# Altium project Nhom4.PrjPcb
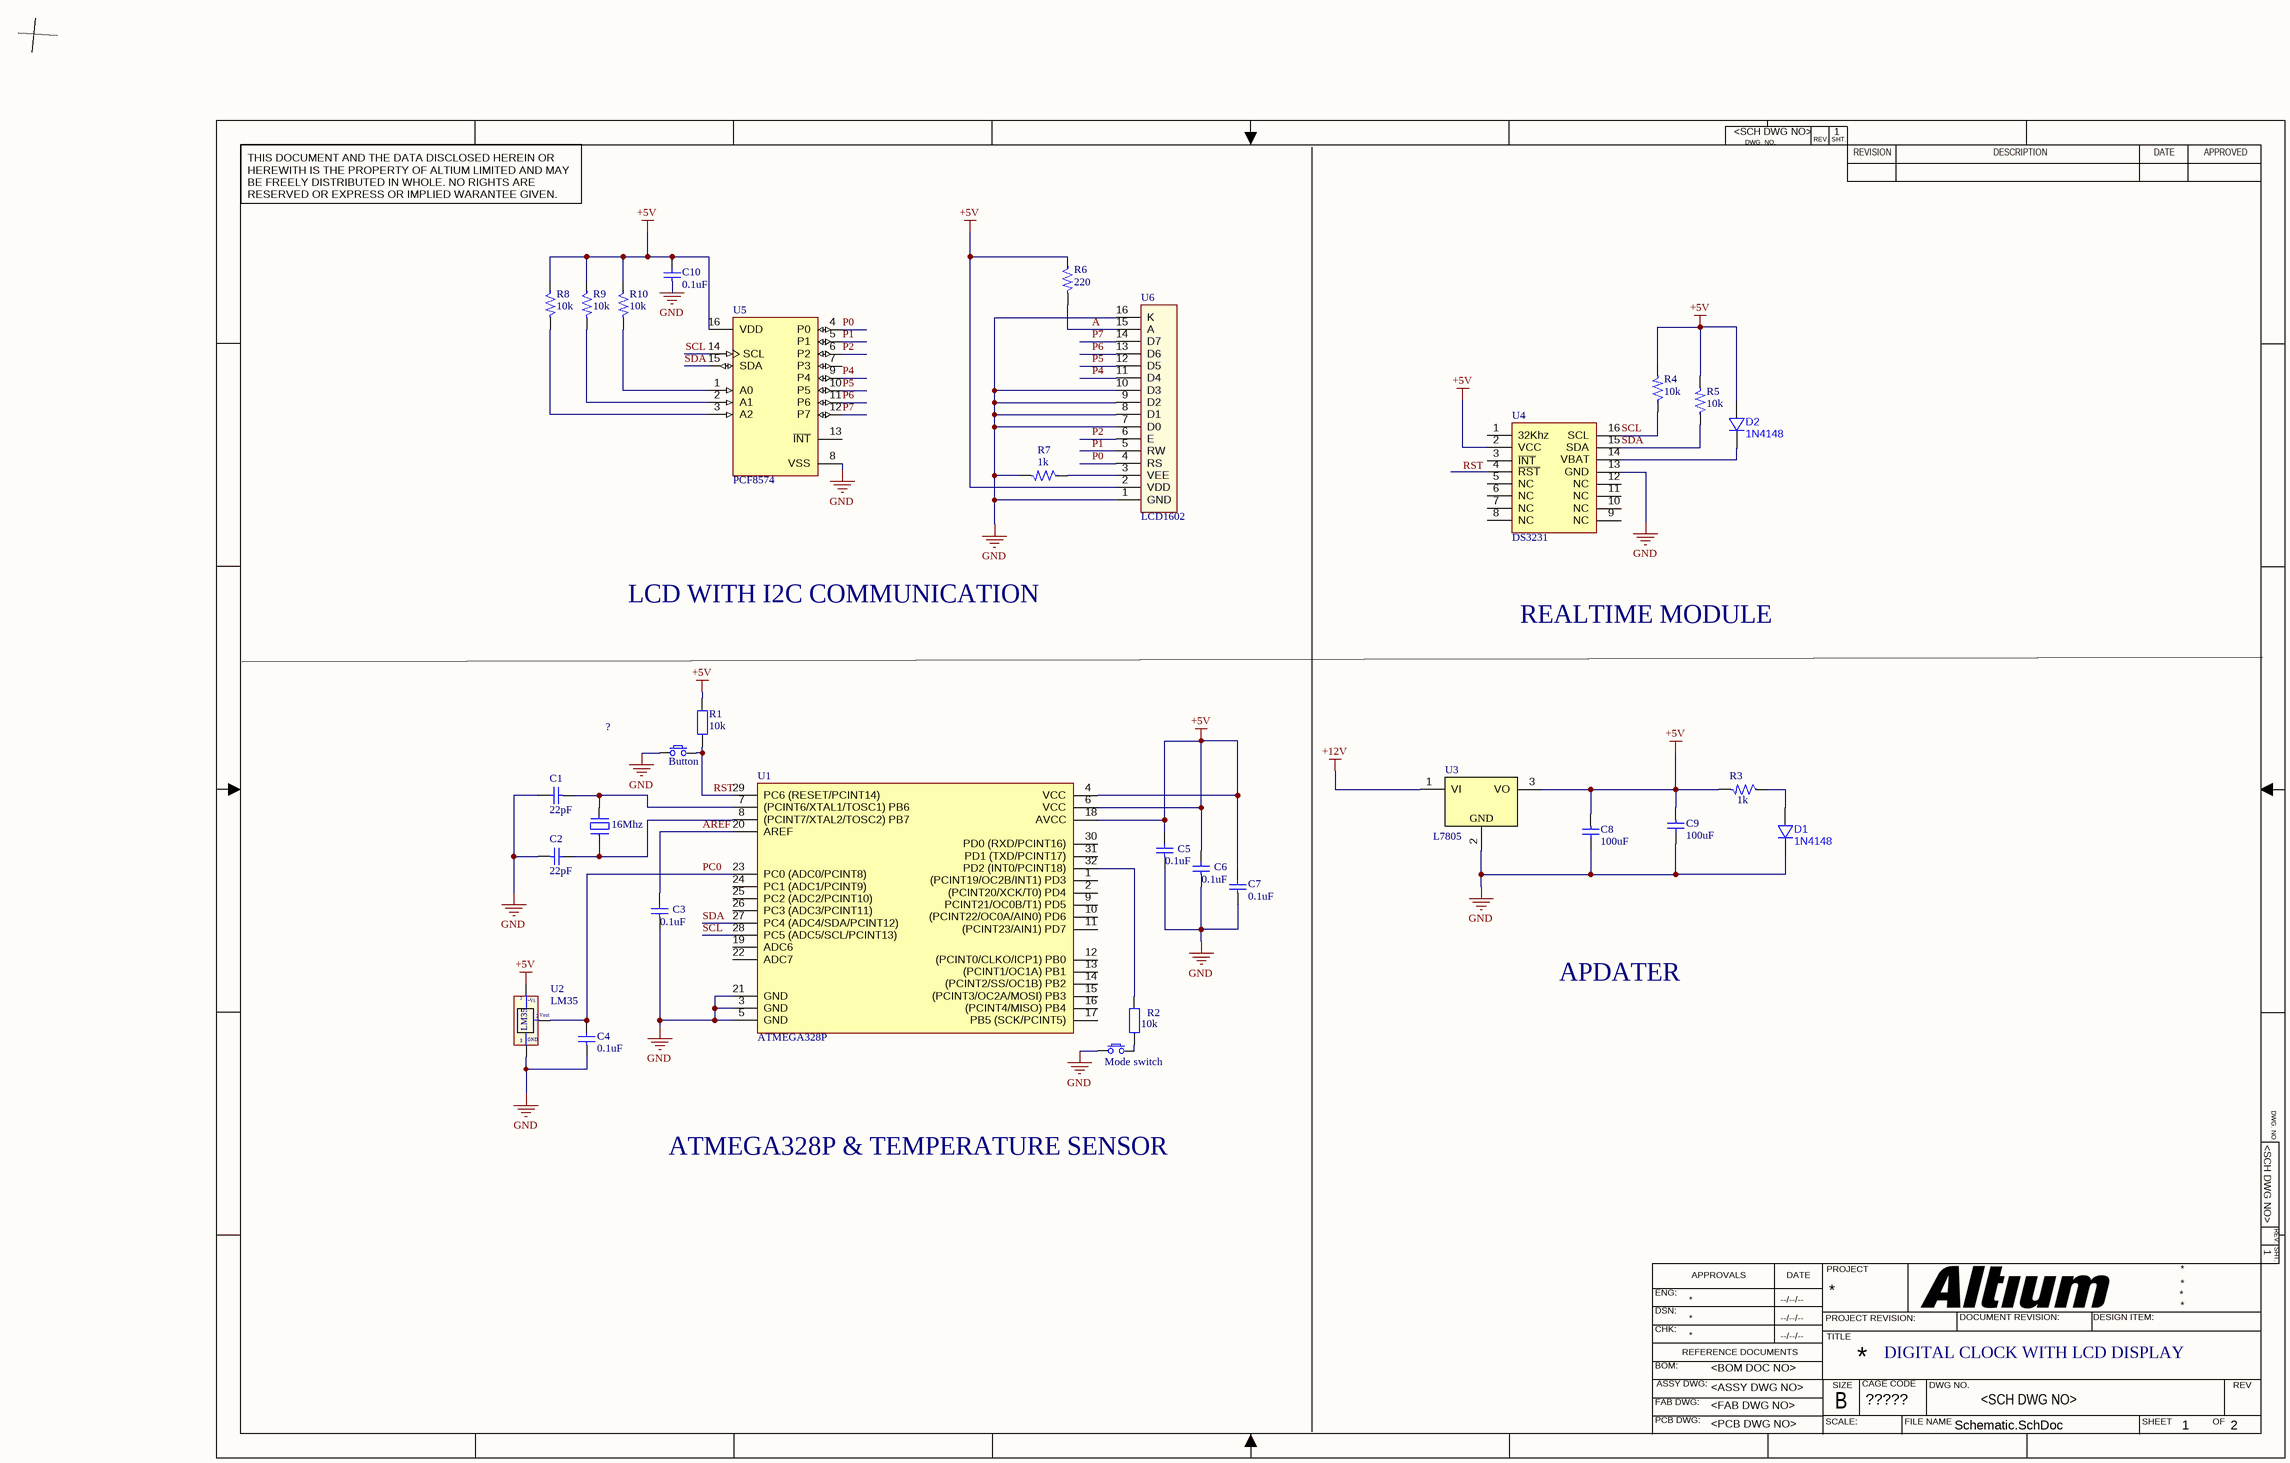
[diagram p0: Schematic.SchDoc]
CAGE_CODE: ?????; CONTRACT_NUMBER: <CONTRACT NO>; DOC_NO_ASSY_DWG: <ASSY DWG NO>; DOC_NO_BOM: <BOM DOC NO>; DOC_NO_FAB_DWG: <FAB DWG NO>; DOC_NO_SCH_DWG: <SCH DWG NO>; PCB_2_DEC_TOL: +/-.01; PCB_3_DEC_TOL: +/-.010; PCB_ANG_TOL: +/-1/2; PCB_ASSEMBLY_NO: <PCB ASSY NO>; PCB_CHECKER: - -----; PCB_CHECKER_APP_DATE: --/--/----; PCB_DESIGNER: - -----; PCB_DESIGNER_APP_DATE: --/--/----; PCB_DWG_NO: <PCB DWG NO>; PCB_ENGINEER: - -----; PCB_ENGINEER_APP_DATE: --/--/----; PCB_PART_NUMBER: <PCB PN>; PCB_REV: A; SCH_REV: A
3 sheets, 71 parts. Net scope: global (net labels, ports and power ports of the same name join across sheets).
Board file: Final PCB.PcbDoc
Sheets:
  Schematic.SchDoc
  Block Diagram.SchDoc
  Final Schematic.SchDoc

## Sheet Schematic.SchDoc
size 431 x 279 mm; SheetNumber: 1; SheetTotal: 2; ENG_APP_DATE: --/--/--; DSN_APP_DATE: --/--/--; CHK_APP_DATE: --/--/--

### Parts
(Parts that share a designator on the sheet are numbered #1, #2 ... from top to bottom, then left to right.)
?#1  Button  [SW/2/DIP]
?#2  16Mhz  [Thach Anh 2 chan SMD]
C1#1  22pF  [C 0402 (1005)]
C2#1  22pF  [C 0402 (1005)]
C3#1  0.1uF  [C 0402 (1005)]
C4#1  0.1uF  [C 0402 (1005)]
C5#1  0.1uF  [C 0402 (1005)]
C6#1  0.1uF  [C 0402 (1005)]
C7#1  0.1uF  [C 0402 (1005)]
C8#1  100uF  [C 0402 (1005)]
C9#1  100uF  [C 0402 (1005)]
C10#1  0.1uF  [C 0402 (1005)]
D1#1  1N4148  [SOD523F]
D2#1  1N4148  [SOD523F]
Mode_switch  (no value)  [SW/2/DIP]
R1#1  10k  [tro vach 1/4w]
R2#1  10k  [tro vach 1/4w]
R3#1  1k  [R1/4W]
R4#1  10k  [R1/4W]
R5#1  10k  [R1/4W]
R6#1  220  [R1/4W]
R7#1  1k  [R1/4W]
R8#1  10k  [SM-RES-1206]
R9#1  10k  [SM-RES-1206]
R10#1  10k  [SM-RES-1206]
U1#1  ATMEGA328P  [TQFP-32]
U2#1  LM35  [QTO-92]
U3#1  L7805  [DPAK_118_446_112X59_SMD]
U4#1  DS3231  [SOIC 16]
U5#1  PCF8574  [FP-SOT162-1-MFG]
U6  LCD1602  [LCD1602 with Jump]

### Nets
+5V: C5#1.2 C6#1.2 C7#1.2 C8#1.1 C9#1.1 C10#1.2 D2#1.A R1#1.2 R3#1.2 R4#1.2 R5#1.2 R6#1.1 R8#1.1 R9#1.1 R10#1.1 U1#1.4(VCC) U1#1.6(VCC) U1#1.18(AVCC) U2#1.1(+Vs) U3#1.3(VO) U4#1.2(VCC) U5#1.16(VDD) U6.2(VDD)
+12V: U3#1.1(VI)
GND: ?#1.1 C1#1.2 C2#1.1 C3#1.1 C4#1.1 C5#1.1 C6#1.1 C7#1.1 C8#1.2 C9#1.2 C10#1.1 D1#1.K Mode_switch.1 R7#1.2 U1#1.3(GND) U1#1.5(GND) U1#1.21(GND) U2#1.3(-) U3#1.2 U4#1.13(GND) U5#1.8(VSS) U6.1(GND) U6.7(D0) U6.8(D1) U6.9(D2) U6.10(D3) U6.16(K)
A: R6#1.2 U6.15(A)
AREF: C3#1.2 U1#1.20(AREF)
P0: U5#1.4(P0) U6.4(RS)
P1: U5#1.5(P1) U6.5(RW)
P2: U5#1.6(P2) U6.6(E)
P4: U5#1.9(P4) U6.11(D4)
P5: U5#1.10(P5) U6.12(D5)
P6: U5#1.11(P6) U6.13(D6)
P7: U5#1.12(P7) U6.14(D7)
PC0: C4#1.2 U1#1.23(PC0_(ADC0/PCINT8)) U2#1.2(Vout)
RST: ?#1.2 R1#1.1 U1#1.29(PC6_(RESET/PCINT14))
SCL: R4#1.1 U1#1.28(PC5_(ADC5/SCL/PCINT13)) U4#1.16(SCL) U5#1.14(SCL)
SDA: R5#1.1 U1#1.27(PC4_(ADC4/SDA/PCINT12)) U4#1.15(SDA) U5#1.15(SDA)
Net?#2_1: ?#2.1 C2#1.2 U1#1.8((PCINT7/XTAL2/TOSC2)_PB7)
Net?#2_2: ?#2.2 C1#1.1 U1#1.7((PCINT6/XTAL1/TOSC1)_PB6)
NetD1#1_A: D1#1.A R3#1.1
NetD2#1_K: D2#1.K U4#1.14(VBAT)
NetMode_switch_2: Mode_switch.2 R2#1.1
NetR2#1_2: R2#1.2 U1#1.32(PD2_(INT0/PCINT18))
NetR7#1_1: R7#1.1 U6.3(VEE)
NetR8#1_2: R8#1.2 U5#1.3(A2)
NetR9#1_2: R9#1.2 U5#1.2(A1)
NetR10#1_2: R10#1.2 U5#1.1(A0)

Not connected (* = marked no-connect by the designer): U1#1 1((PCINT19/OC2B/INT1)_PD3) 2((PCINT20/XCK/T0)_PD4) 9(PCINT21/OC0B/T1)_PD5) 10((PCINT22/OC0A/AIN0)_PD6) 11((PCINT23/AIN1)_PD7) 12((PCINT0/CLKO/ICP1)_PB0) 13((PCINT1/OC1A)_PB1) 14((PCINT2/SS/OC1B)_PB2) 15((PCINT3/OC2A/MOSI)_PB3) 16((PCINT4/MISO)_PB4) 17(PB5_(SCK/PCINT5)) 19(ADC6) 22(ADC7) 24(PC1_(ADC1/PCINT9)) 25(PC2_(ADC2/PCINT10)) 26(PC3_(ADC3/PCINT11)) 30(PD0_(RXD/PCINT16)) 31(PD1_(TXD/PCINT17)); U4#1 1(32Khz) 3(~{INT}) 4(~{RST}) 5(NC) 6(NC) 7(NC) 8(NC) 9(NC) 10(NC) 11(NC) 12(NC); U5#1 7(P3) 13(~{INT})

### Notes on the sheet
- LCD WITH I2C COMMUNICATION
- REALTIME MODULE
- APDATER
- ATMEGA328P & TEMPERATURE SENSOR
- DIGITAL CLOCK WITH LCD DISPLAY
- Labels drawn without touching a wire or pin: RST
- DWG. NO.
- REV.
- SHT.
- THIS DOCUMENT AND THE DATA DISCLOSED HEREIN OR HEREWITH IS THE PROPERTY OF ALTIUM LIMITED AND MAY BE FREELY DISTRIBUTED IN WHOLE. NO RIGHTS ARE RESERVED OR EXPRESS OR IMPLIED WARANTEE GIVEN.
- REVISION
- DESCRIPTION
- DATE
- APPROVED
- ENG:
- APPROVALS
- PROJECT
- DSN:
- CHK:
- REFERENCE DOCUMENTS
- PROJECT REVISION:
- TITLE
- DOCUMENT REVISION:
- DESIGN ITEM:
- BOM:
- FAB DWG:
- PCB DWG:
- ASSY DWG:
- SCALE:
- SIZE
- B
- CAGE CODE
- FILE NAME
- DWG NO.
- SHEET
- OF
- REV
- (in symbol LM35) GND
- (in symbol REG_35V_5V-1.5A-7.5W-DPAK) GND

### Library data of the parts
?#1 Mode_switch = SW SPST: Tact switch 2 pin
?#2 = Thach Anh 2 chan SMD: Crystal For all Crystal 2pin.; Value: 4Mhz
C1#1 C2#1 C3#1 C4#1 C5#1 C6#1 C7#1 C8#1 C9#1 C10#1 = Capacitor NP: Capacitor non-pol
D1#1 D2#1 = DIODE_1N4148_200mA_SOD523F: Diode SMD small signal 0.2A SOD-523F; Manufacturer 1: Fairchild Semiconductor; Manufacturer Part Number 1: 1N4148WT; Ratings: Vr=75V; Vf=1V@10mA; Io=200mA; Material: Si; SCDType: source; Package / Case: SC-79, SOD-523F; Supplier 1: Digi-Key; Supplier Part Number 1: 1N4148WTCT-ND; ComponentLink1URL: http://www.fairchildsemi.com/ds/1N/1N914BWT.pdf; ComponentLink1Description: http://www.fairchildsemi.com/ds/1N/1N914BWT.pdf; Value: 1N4148
R1#1 R2#1 = Tro Vach 1/4W 5% 10k: Căm; Chung_Loai: Cắm; Don_Vi: Con; So_Chan: 2; Ten_Linh_Kien: Trở Vạch 1/4w 5% 10K; Ma_Hang: MH007354; Kieu_Chan: *
R3#1 R4#1 R5#1 R6#1 R7#1 = Res
R8#1 R9#1 R10#1 = R: Resistor 1/4W; Value: R1/4W - 1K
U1#1 = IC_ATMEGA328P: AVR AVR® ATmega Microcontroller IC 8-Bit 20MHz 32KB (16K x 16) FLASH 32-TQFP (7x7); Manufacturer: Microchip Technology; Manufacturer Part Number: ATMEGA328P-AUR; Alternate Part Number-1: NA; Case/Package: 32-TQFP; Supplier-1: Arrow; Supplier Part Number-1: ATMEGA328P-AUR
U2#1 = LM35: Teminal; Value: LM35
U3#1 = REG_35V_5V-1.5A-7.5W-DPAK: Linear Voltage Regulator IC 1 Output 1.5A DPAK; Manufacturer: Diodes; Manufacturer Part Number: L7805CDT-TR; Alternate Part Number-1: CJ7805 3%; Case/Package: DPAK; Supplier-1: SP ROAD; Supplier Part Number-1: L7805CDT-TR
U4#1 = DS3231 SMD: SOIC
U5#1 = CMP-10112-000010-1: IC I/O EXPANDER I2C 8B 16SOIC; Manufacturer Part Number: PCF8574T/3,518; Manufacturer: NXP Semiconductors; Frequency: 100kHz; Max Supply Voltage: 6V; Standoff Height: 0.1mm; Nominal Supply Current: 40uA; Max Junction Temp: +125°C; Min Supply Voltage: 2.5V; Number Of I/Os: 8; Footprint Url: https://www.nxp.com/docs/en/package-information/SOT162-1.pdf; ComponentLink2URL: https://www.nxp.com/docs/en/data-sheet/PCF8574_PCF8574A.pdf; Automotive: No; Digikey Description: IC I/O EXPANDER I2C 8B 16SOIC; Mouser Description: PCF8574 Series 2.5 - 6V Remote 8-bit I/O Expander for I2C-bus - SOIC-16; Ipc Land Pattern Name: SOIC127P1032X265-16; Interface: I2C; Octopart: https://octopart.com/pcf8574t%2F3%2C518-nxp+semiconductors-10470852; Ambient Temperature Range Low: -40°C; Lead Free: Yes; Device Class L2: Interface ICs; Temperature Range High: +85°C; Device Class L1: Integrated Circuits (ICs); Package: SOT162-1; ComponentLink2Description: Datasheet; Device Class L3: I/O Expanders; Temperature: -40°C to +85°C; Ambient Temperature Range High: +85°C; Height: 2.65mm; Category: IC; RoHS: TRUE; Temperature Range Low: -40°C
U6 = LCD1602 XL: LCD 1602 Xanh Lá; Ten: Màn hình LCD 1602 Xanh Lá; Ma_Hang: 67HZ; NCC: NSHOP; CHIP: HD44780

## Sheet Block Diagram.SchDoc
size A4; SheetNumber: 1; SheetTotal: 2
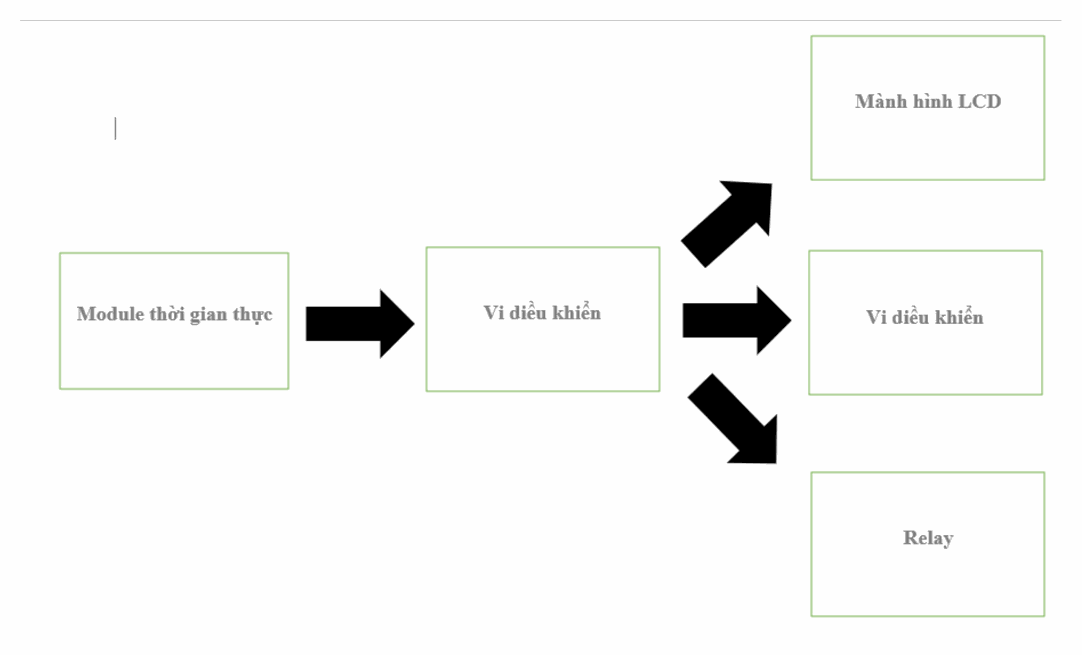
[diagram p1: Block Diagram.SchDoc]

## Sheet Final Schematic.SchDoc
size A4; SheetNumber: 1; SheetTotal: 1
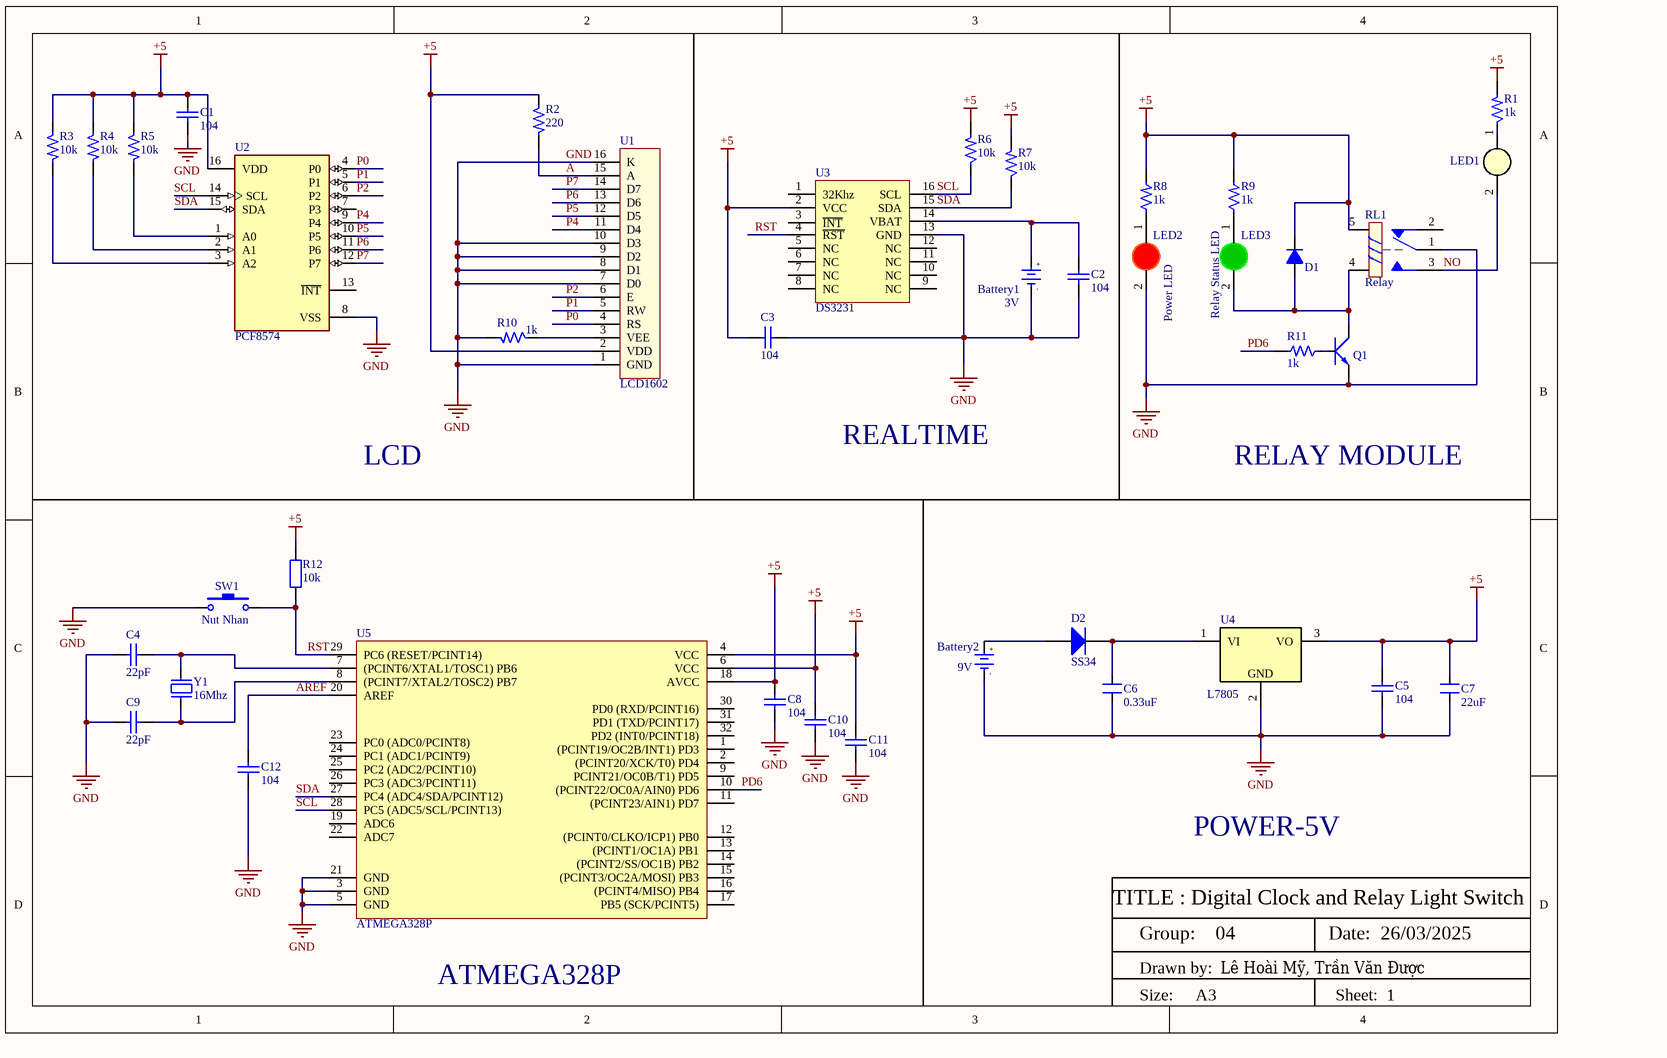
[diagram p2: Final Schematic.SchDoc]

### Parts
(Parts that share a designator on the sheet are numbered #1, #2 ... from top to bottom, then left to right.)
Battery1  3V  [PIN 3.6V 20mAh 3/V20H]
Battery2  9V  [De Pin 9V]
C1#2  104  [tu gom]
C2#2  104  [tu gom]
C3#2  104  [tu gom]
C4#2  22pF  [tu gom]
C5#2  104  [tu gom]
C6#2  0.33uF  [CN1]
C7#2  22uF  [CN1]
C8#2  104  [tu gom]
C9#2  22pF  [tu gom]
C10#2  104  [tu gom]
C11  104  [tu gom]
C12  104  [tu gom]
D1#2  100v  [DIODE 1A]  (value not drawn)
D2#2  SS34  [DIODE SMA]
LED1  LED 3mm  [LED-3MM-WHITE]  (value not drawn)
LED2  Power LED  [LED-3MM-RED]
LED3  Relay Status LED  [LED-3MM-GREEN]
Q1  ?  [TO92]  (value not drawn)
R1#2  1k  [R1/4W]
R2#2  220  [R1/4W]
R3#2  10k  [R1/4W]
R4#2  10k  [R1/4W]
R5#2  10k  [R1/4W]
R6#2  10k  [R1/4W]
R7#2  10k  [R1/4W]
R8#2  1k  [R1/4W]
R9#2  1k  [R1/4W]
R10#2  1k  [R1/4W]
R11  1k  [R1/4W]
R12  10k  [tro vach 1/4w]
RL1  Relay  [Relay 5 Chan SRD]
SW1  Nut Nhan  [Nut Nhan 2 Chan SMD 3x6x2.5]
U1#2  LCD1602  [LCD1602 with Jump]
U2#2  PCF8574  [FP-SOT162-1-MFG]
U3#2  DS3231  [SOIC 16]
U4#2  L7805  [DPAK_118_446_112X59_SMD]
U5#2  ATMEGA328P  [TQFP-32]
Y1  16Mhz  [Thach Anh 2 chan SMD]

### Nets
+5: C1#2.2 C3#2.2 C5#2.1 C7#2.2 C8#2.2 C10#2.2 C11.2 D1#2.2(K) R1#2.2 R2#2.1 R3#2.1 R4#2.1 R5#2.1 R6#2.2 R7#2.2 R8#2.2 R9#2.2 R12.2 RL1.5 U1#2.2(VDD) U2#2.16(VDD) U3#2.2(VCC) U4#2.3(VO) U5#2.4(VCC) U5#2.6(VCC) U5#2.18(AVCC)
GND: Battery1.2(GND) Battery2.2(GND) C1#2.1 C2#2.1 C3#2.1 C4#2.2 C5#2.2 C6#2.1 C7#2.1 C8#2.1 C9#2.1 C10#2.1 C11.1 C12.1 LED2.2(K) Q1.1(E) R10#2.2 RL1.1 SW1.1 U1#2.1(GND) U1#2.7(D0) U1#2.8(D1) U1#2.9(D2) U1#2.10(D3) U1#2.16(K) U2#2.8(VSS) U3#2.13(GND) U4#2.2 U5#2.3(GND) U5#2.5(GND) U5#2.21(GND)
A: R2#2.2 U1#2.15(A)
AREF: C12.2 U5#2.20(AREF)
NO: LED1.2(K) RL1.3
P0: U1#2.4(RS) U2#2.4(P0)
P1: U1#2.5(RW) U2#2.5(P1)
P2: U1#2.6(E) U2#2.6(P2)
P4: U1#2.11(D4) U2#2.9(P4)
P5: U1#2.12(D5) U2#2.10(P5)
P6: U1#2.13(D6) U2#2.11(P6)
P7: U1#2.14(D7) U2#2.12(P7)
PD6: R11.2 U5#2.10((PCINT22/OC0A/AIN0)_PD6)
RST: R12.1 SW1.2 U3#2.4(~{RST}) U5#2.29(PC6_(RESET/PCINT14))
SCL: R6#2.1 U2#2.14(SCL) U3#2.16(SCL) U5#2.28(PC5_(ADC5/SCL/PCINT13))
SDA: R7#2.1 U2#2.15(SDA) U3#2.15(SDA) U5#2.27(PC4_(ADC4/SDA/PCINT12))
NetBattery1_1: Battery1.1(+3V) C2#2.2 U3#2.14(VBAT)
NetBattery2_1: Battery2.1(+3V) D2#2.1(A)
NetC4#2_1: C4#2.1 U5#2.7((PCINT6/XTAL1/TOSC1)_PB6) Y1.2
NetC6#2_2: C6#2.2 D2#2.2(K) U4#2.1(VI)
NetC9#2_2: C9#2.2 U5#2.8((PCINT7/XTAL2/TOSC2)_PB7) Y1.1
NetD1#2_1: D1#2.1(A) LED3.2(K) Q1.3(C) RL1.4
NetLED1_1: LED1.1(A) R1#2.1
NetLED2_1: LED2.1(A) R8#2.1
NetLED3_1: LED3.1(A) R9#2.1
NetQ1_2: Q1.2(B) R11.1
NetR3#2_2: R3#2.2 U2#2.3(A2)
NetR4#2_2: R4#2.2 U2#2.2(A1)
NetR5#2_2: R5#2.2 U2#2.1(A0)
NetR10#2_1: R10#2.1 U1#2.3(VEE)

Not connected (* = marked no-connect by the designer): RL1 2; U2#2 7(P3) 13(~{INT}); U3#2 1(32Khz) 3(~{INT}) 5(NC) 6(NC) 7(NC) 8(NC) 9(NC) 10(NC) 11(NC) 12(NC); U5#2 1((PCINT19/OC2B/INT1)_PD3) 2((PCINT20/XCK/T0)_PD4) 9(PCINT21/OC0B/T1)_PD5) 11((PCINT23/AIN1)_PD7) 12((PCINT0/CLKO/ICP1)_PB0) 13((PCINT1/OC1A)_PB1) 14((PCINT2/SS/OC1B)_PB2) 15((PCINT3/OC2A/MOSI)_PB3) 16((PCINT4/MISO)_PB4) 17(PB5_(SCK/PCINT5)) 19(ADC6) 22(ADC7) 23(PC0_(ADC0/PCINT8)) 24(PC1_(ADC1/PCINT9)) 25(PC2_(ADC2/PCINT10)) 26(PC3_(ADC3/PCINT11)) 30(PD0_(RXD/PCINT16)) 31(PD1_(TXD/PCINT17)) 32(PD2_(INT0/PCINT18))

### Notes on the sheet
- REALTIME
- LCD
- RELAY MODULE
- POWER-5V
- TITLE : Digital Clock and Relay Light Switch
- ATMEGA328P
- Group:    04
- Drawn by:
- Lê Hoài Mỹ, Trần Văn Được
- Date:  26/03/2025
- Size:     A3
- Sheet:  1
- (in symbol De pin 9V cam) +; -
- (in symbol PIN 3V) +; -
- (in symbol REG_35V_5V-1.5A-7.5W-DPAK) GND

### Library data of the parts
Battery1 = PIN 3V: Battery 3VDC , NI-MH 3.6V 20mAh 3/V20H; Value: PIN 3V
Battery2 = De pin 9V cam: De Pin 9V; Ten: Hộp Đế Pin 9V Thường; Ma_Hang: MH002680
C1#2 C2#2 C3#2 C5#2 C10#2 C12 = Tu gom 104 50V: Cắm; So_Chan: 2; Ten_Linh_Kien: Tụ gốm 104 100nF 50V; Don_Vi: Con; Ma_Hang: MH004761; Chung_Loai: Cắm; Kieu_Chan: *
C4#2 C9#2 = Tu gom 22pF 50V: Cắm; Don_Vi: Con; So_Chan: 2; Ten_Linh_Kien: Tụ gốm 22P 50V; Ma_Hang: MH004771; Chung_Loai: Cắm; Kieu_Chan: *
C6#2 C7#2 = CAP gom
C8#2 C11 = Tu gom 104 50V: Cắm; Don_Vi: Con; So_Chan: 2; Ten_Linh_Kien: Tụ gốm 104 100nF 50V; Ma_Hang: MH004761; Chung_Loai: Cắm; Kieu_Chan: *
D1#2 = Diode 1N4007: Cắm; Ten_Linh_Kien: Diode 1N4007 1A (DIP); Don_Vi: Con; Ma_Hang: MH001063; Ghi Chu: *; Kieu_Chan: *; Chung_Loai: Cắm
D2#2 = Diode SS34 ( 1N5822 ): Dán; Don_Vi: Con; Ma_Hang: MH002104; Ten_Linh_Kien: Diode SS34 3A 40V SMA ( 1N5822 SS34A); Kieu_Chan: *; Chung_Loai: Dán
LED1 = LED 3mm Trang: Cắm; Don_Vi: Con; Ma_Hang: MH009001; Ten_Linh_Kien: LED 3MM Trắng SS (1000c); Ghi_Chu: *; Kieu_Chan: *; Chung_Loai: Cắm
LED2 = LED 3mm Do: Cắm; Don_Vi: Con; Ma_Hang: MH003892; Ten_Linh_Kien: Led 3MM Phủ Đỏ (10c); Ghi_Chu: *; Kieu_Chan: *; Chung_Loai: Cắm
LED3 = LED 3mm Xanh La: Cắm; Don_Vi: Con; Ma_Hang: MH001054; Ten_Linh_Kien: Led 3MM Phủ Xanh (10c); Ghi_Chu: *; Kieu_Chan: *; Chung_Loai: Cắm
Q1 = Trans 2N3904: NPN transistor EBC; Value: C9014
R1#2 R2#2 R3#2 R4#2 R5#2 R6#2 R7#2 R8#2 R9#2 R10#2 R11 = Res
R12 = Tro Vach 1/4W 5% 10k: as R1#1 on sheet Schematic; Kieu_Chan: *
RL1 = Relay 5 Chan SRD: Relay 5 Chan; Ma_Hang: MH009374; Ten: Relay 5V10A SRD-05VDC-SL-C Chính Hãng
SW1 = Nut Nhan 2 Chan SMD 3x6x2.5: Ma_Hang: MH001036; Ten: Nút Nhấn 2 Chân 3x6x2.5MM SMD
U1#2 = LCD1602 XL: as U6 on sheet Schematic
U2#2 = CMP-10112-000010-1: as U5#1 on sheet Schematic; Footprint Url: https://www.nxp.com/docs/en/package-information/SOT162-1.pdf; ComponentLink2URL: https://www.nxp.com/docs/en/data-sheet/PCF8574_PCF8574A.pdf; Automotive: No; Digikey Description: IC I/O EXPANDER I2C 8B 16SOIC; Mouser Description: PCF8574 Series 2.5 - 6V Remote 8-bit I/O Expander for I2C-bus - SOIC-16; Ipc Land Pattern Name: SOIC127P1032X265-16; Interface: I2C; Octopart: https://octopart.com/pcf8574t%2F3%2C518-nxp+semiconductors-10470852; Ambient Temperature Range Low: -40°C; Lead Free: Yes; Device Class L2: Interface ICs; Temperature Range High: +85°C; Device Class L1: Integrated Circuits (ICs); Package: SOT162-1; ComponentLink2Description: Datasheet; Device Class L3: I/O Expanders; Temperature: -40°C to +85°C; Ambient Temperature Range High: +85°C; Height: 2.65mm; Category: IC; RoHS: TRUE; Temperature Range Low: -40°C
U3#2 = DS3231 SMD: SOIC
U4#2 = REG_35V_5V-1.5A-7.5W-DPAK: as U3#1 on sheet Schematic; Case/Package: DPAK; Supplier-1: SP ROAD; Supplier Part Number-1: L7805CDT-TR
U5#2 = IC_ATMEGA328P: as U1#1 on sheet Schematic; Case/Package: 32-TQFP; Supplier-1: Arrow; Supplier Part Number-1: ATMEGA328P-AUR
Y1 = Thach Anh 2 chan SMD: as ?#2 on sheet Schematic

## Nets that join several sheets
GND: Schematic (27 pins), Final Schematic (31 pins)
A: Schematic (R6#1.2 U6.15), Final Schematic (R2#2.2 U1#2.15)
AREF: Schematic (C3#1.2 U1#1.20), Final Schematic (C12.2 U5#2.20)
P0: Schematic (U5#1.4 U6.4), Final Schematic (U1#2.4 U2#2.4)
P1: Schematic (U5#1.5 U6.5), Final Schematic (U1#2.5 U2#2.5)
P2: Schematic (U5#1.6 U6.6), Final Schematic (U1#2.6 U2#2.6)
P4: Schematic (U5#1.9 U6.11), Final Schematic (U1#2.11 U2#2.9)
P5: Schematic (U5#1.10 U6.12), Final Schematic (U1#2.12 U2#2.10)
P6: Schematic (U5#1.11 U6.13), Final Schematic (U1#2.13 U2#2.11)
P7: Schematic (U5#1.12 U6.14), Final Schematic (U1#2.14 U2#2.12)
RST: Schematic (?#1.2 R1#1.1 U1#1.29), Final Schematic (R12.1 SW1.2 U3#2.4 U5#2.29)
SCL: Schematic (R4#1.1 U1#1.28 U4#1.16 U5#1.14), Final Schematic (R6#2.1 U2#2.14 U3#2.16 U5#2.28)
SDA: Schematic (R5#1.1 U1#1.27 U4#1.15 U5#1.15), Final Schematic (R7#2.1 U2#2.15 U3#2.15 U5#2.27)